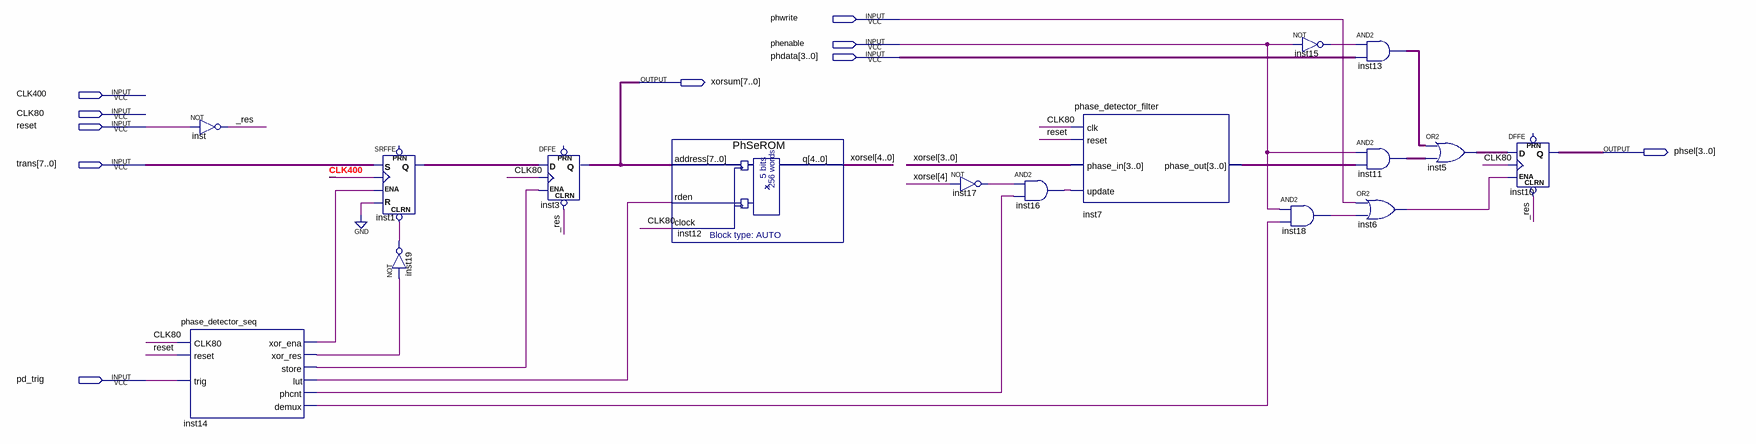
[diagram p0: schematic sheet]
// Quartus schematic phase_detector.bdf as structural Verilog: 16 symbols, 10 pins
module phase_detector (
  input  phwrite,
  input  phenable,
  input  [3:0] phdata,
  input  CLK400,
  input  CLK80,
  input  reset,
  input  [7:0] trans,
  input  pd_trig,
  output [7:0] xorsum,
  output [3:0] phsel
);

  wire _res, inst6_out, inst14_demux, inst14_lut, inst14_phcnt, inst14_store, inst14_xor_ena, inst14_xor_res,
       inst15_out, inst16_out, inst17_out, inst18_out, inst19_out;
  wire [3:0] inst5_out, inst7_phase_out, inst11_out, inst13_out;
  wire [4:0] xorsel;
  wire [7:0] inst1_q;

  not inst (_res, reset);
  phase_detector_seq inst14 (
    .CLK80(CLK80), .reset(reset), .trig(pd_trig), .xor_ena(inst14_xor_ena), .xor_res(inst14_xor_res),
    .store(inst14_store), .lut(inst14_lut), .phcnt(inst14_phcnt), .demux(inst14_demux));
  SRFFE inst1[7:0] (
    .S(trans), .CLK(CLK400), .CLRN(inst19_out), .R(1'b0), .ENA(inst14_xor_ena), .Q(inst1_q));  // open: PRN
  not inst19 (inst19_out, inst14_xor_res);
  DFFE inst3[7:0] (.CLRN(_res), .D(inst1_q), .CLK(CLK80), .ENA(inst14_store), .Q(xorsum));  // open: PRN
  PhSeROM inst12 (.address(xorsum), .rden(inst14_lut), .clock(CLK80), .q(xorsel));
  not inst17 (inst17_out, xorsel[4]);
  and inst16 (inst16_out, inst17_out, inst14_phcnt);
  phase_detector_filter inst7 (
    .clk(CLK80), .reset(reset), .update(inst16_out), .phase_in(xorsel[3:0]), .phase_out(inst7_phase_out));
  and inst18 (inst18_out, phenable, inst14_demux);
  not inst15 (inst15_out, phenable);
  assign inst13_out = {4{inst15_out}} & phdata;  // AND2 inst13, 4 bits wide
  assign inst11_out = {4{phenable}} & inst7_phase_out;  // AND2 inst11, 4 bits wide
  or inst6 (inst6_out, phwrite, inst18_out);
  assign inst5_out = inst13_out | inst11_out;  // OR2 inst5, 4 bits wide
  DFFE inst10[3:0] (.CLRN(_res), .D(inst5_out), .CLK(CLK80), .ENA(inst6_out), .Q(phsel));  // open: PRN
endmodule
